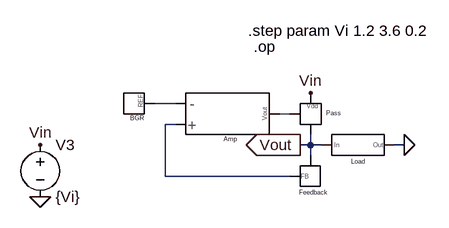
[diagram p0: schematic ldo_regulator_ic.asc]
ldo_regulator_ic.asc, the LTspice schematic file:
Version 4
SHEET 1 940 680
WIRE 96 112 64 112
WIRE 272 128 256 128
WIRE 96 144 80 144
WIRE 304 176 304 160
WIRE 304 176 288 176
WIRE 320 176 304 176
WIRE 448 176 432 176
WIRE 304 192 304 176
WIRE 80 224 80 144
WIRE 272 224 80 224
FLAG 448 176 0
FLAG -112 256 0
FLAG 288 176 Vout
IOPIN 288 176 Out
FLAG -112 176 Vin
FLAG 304 96 Vin
SYMBOL error_amplifier 192 96 M180
WINDOW 0 -22 -71 Left 0
SYMATTR InstName Amp
SYMBOL feedback_network 352 256 R0
WINDOW 0 -66 -7 Left 0
SYMATTR InstName Feedback
SYMBOL load 416 144 M180
WINDOW 0 -50 -57 Left 0
SYMATTR InstName Load
SYMBOL voltage -112 160 R0
SYMATTR InstName V3
SYMATTR Value {Vi}
SYMBOL pass_element 352 176 R0
WINDOW 0 -24 -49 Left 0
SYMATTR InstName Pass
SYMBOL bandgap_reference 96 128 R0
WINDOW 0 -70 6 Left 0
SYMATTR InstName BGR
TEXT 208 0 Left 2 !.step param Vi 1.2 3.6 0.2
TEXT 216 24 Left 2 !.op

The netlist it stands for:
* ldo_regulator_ic.asc
XAmp N003 N001 N002 error_amplifier  ; pins V+ V- Vout
XFeedback Vout N003 feedback_network  ; pins In Fb
XLoad Vout 0 load  ; pins 1 2
V3 Vin 0 {Vi}
XPass Vin Vout N002 pass_element  ; pins Vdd Out Ctrl
XBGR N001 bandgap_reference  ; pins Vref
.step param Vi 1.2 3.6 0.2
.op
.backanno
.end